# Altium schematic sheet Sun_Gold_Power_#2_Topology.SchDoc
size A4
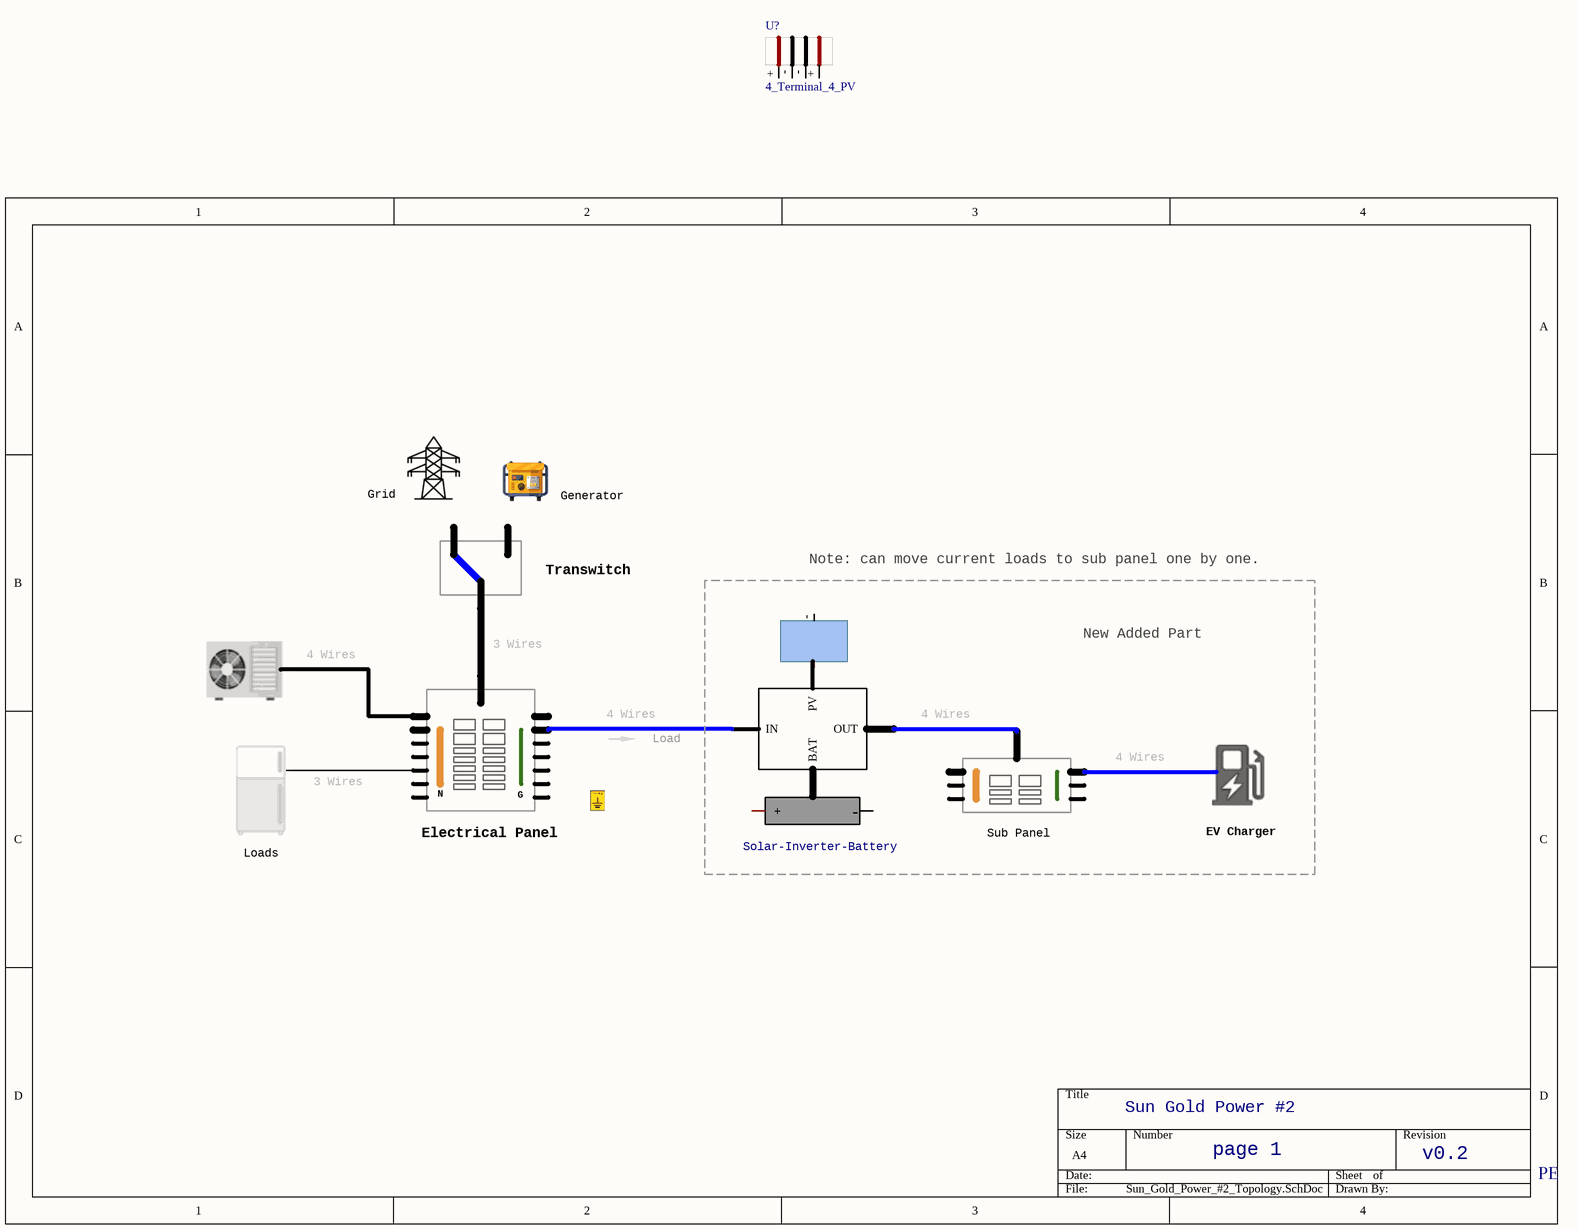
[diagram p0: Sun_Gold_Power_#2_Topology.SchDoc]

## Parts
(Parts that share a designator on the sheet are numbered #1, #2 ... from top to bottom, then left to right.)
Battery?  1_BAT_48V_new  (value not drawn)
U?#1  4_Terminal_4_PV
U?#2  3_Relay_Transit  (value not drawn)
U?#3  0_Solar_Panel_36V_new  (value not drawn)
U?#4  6_Hybrid_Inverter  (value not drawn)
U?#5  6_Electrical_Panel  (value not drawn)
U?#6  6_Electrical_Panel_small  (value not drawn)

## Nets
NetU?#2_3: U?#2.3 U?#5.1
NetU?#4_2: U?#4.2(IN) U?#5.2
NetU?#4_5: U?#4.5(OUT) U?#6.1

Not connected (* = marked no-connect by the designer): Battery? 1(-) 2(+); U?#1 + -; U?#2 1 2; U?#3 + -; U?#4 1(PV) 4(BAT); U?#6 2

## Notes on the sheet
- Grid
- Generator
- (near U?#2) Transwitch
- (near U?#3) Note: can move current loads to sub panel one by one.
- New Added Part
- 4 Wires
- (near U?#5) 3 Wires
- Load
- (near U?#6) 4 Wires
- 3 Wires
- (near U?#5) Electrical Panel
- (near U?#5) N
- (near U?#5) G
- (near U?#6) Sub Panel
- EV Charger
- Loads
- (near Battery?) Solar-Inverter-Battery
- Sun Gold Power #2
- page 1
- v0.2
- PE